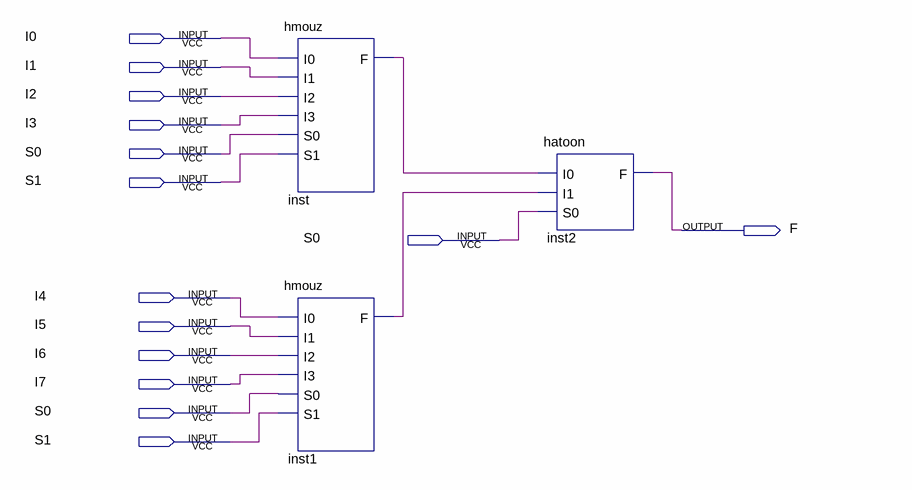
[diagram p0: schematic sheet]
// Quartus schematic h1241706block.bdf as structural Verilog: 3 symbols, 14 pins
module h1241706block (
  input  I0,
  input  I1,
  input  I2,
  input  I3,
  input  S0,
  input  S1,
  input  I4,
  input  I5,
  input  I6,
  input  I7,
  output F
);

  wire inst1_f, inst_f;

  hmouz inst (.I0(I0), .I1(I1), .I2(I2), .I3(I3), .S0(S0), .S1(S1), .F(inst_f));
  hmouz inst1 (.I0(I4), .I1(I5), .I2(I6), .I3(I7), .S0(S0), .S1(S1), .F(inst1_f));
  hatoon inst2 (.I0(inst_f), .I1(inst1_f), .S0(S0), .F(F));
endmodule
